# EasyEDA Pro project 800480_4.3LCD.eprj

# Schematic Schematic1
Board Name: Board1; Create Date: 2024-09-07
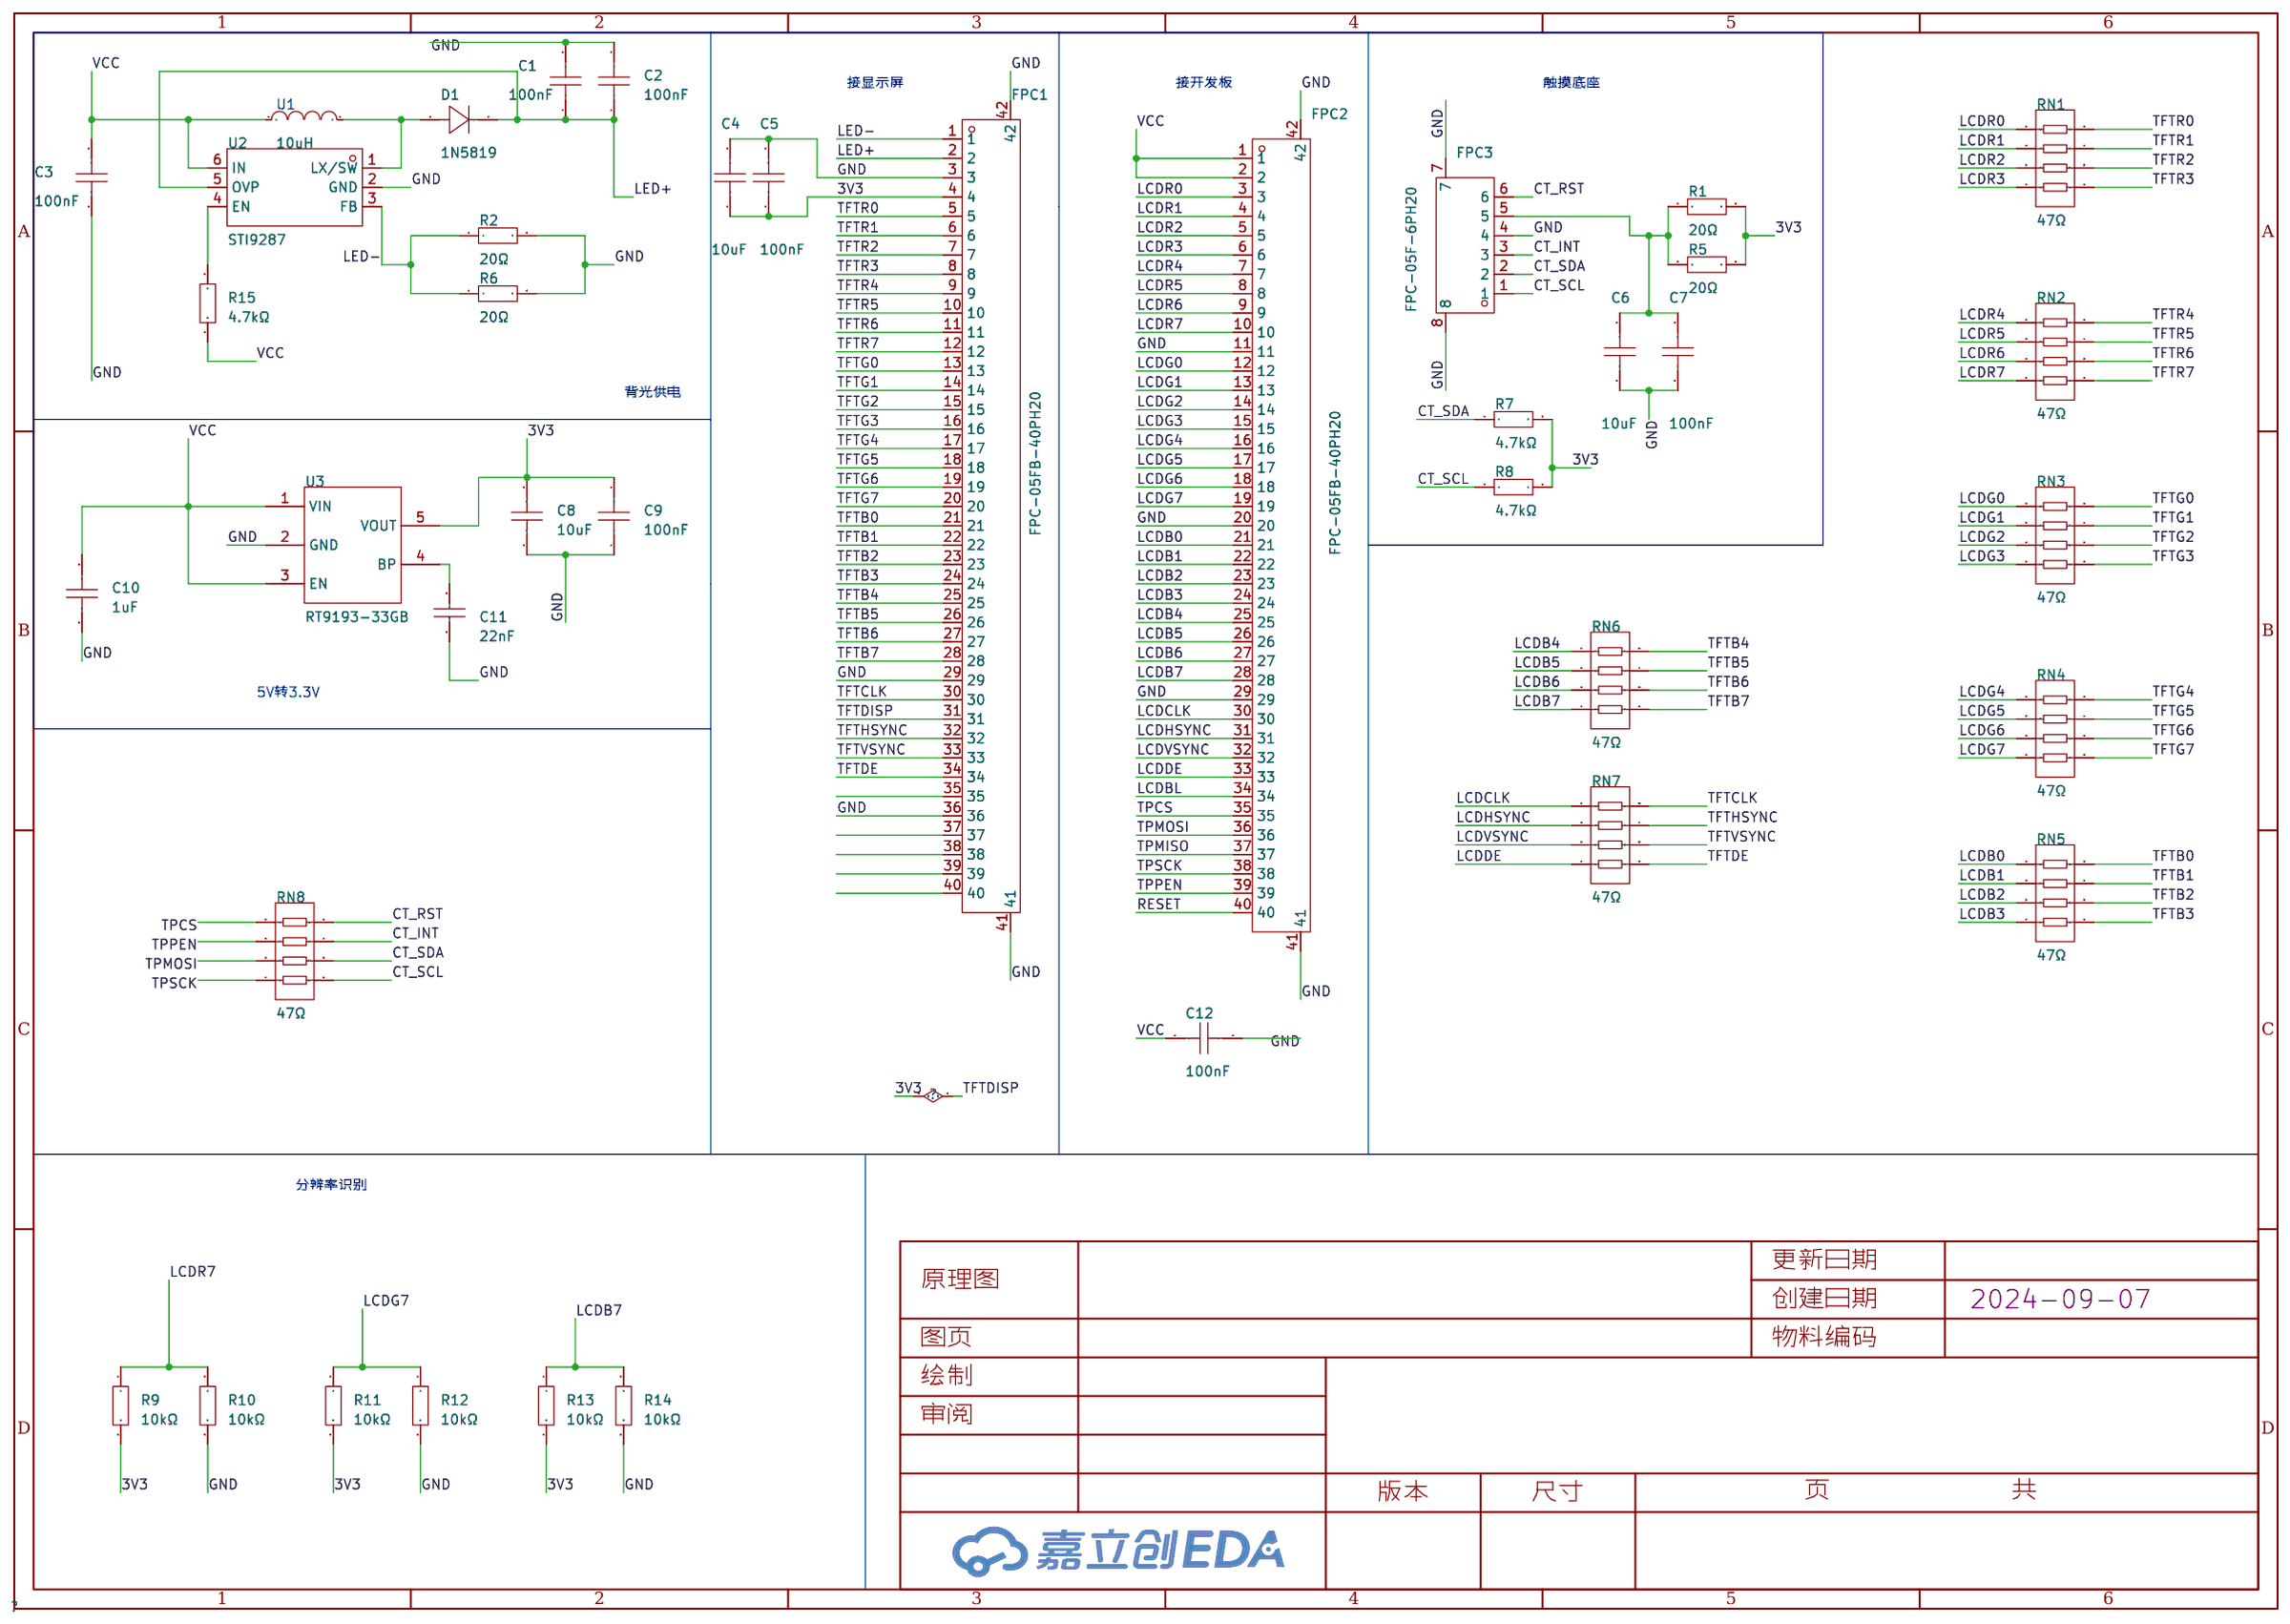
[diagram p0: schematic sheet]

## Parts
C1  100nF  [C0603]
C2  100nF  [C0603]
C3  100nF  [C0603]
C4  10uF  [C0603]
C5  100nF  [C0603]
C6  10uF  [C0603]
C7  100nF  [C0603]
C8  10uF  [C0603]
C9  100nF  [C0603]
C10  1uF  [C0603]
C11  22nF  [C0603]
C12  100nF  [C0603]
D1  1N5819  [SMA_L4.3-W2.6-LS5.1-RD]
FPC1  FPC-05FB-40PH20  [FPC-SMD_40P-P0.50_XUNPU_FPC-05FB-40PH20]
FPC2  FPC-05FB-40PH20  [FPC-SMD_40P-P0.50_XUNPU_FPC-05FB-40PH20]
FPC3  FPC-05F-6PH20  [FPC-SMD_6P-P0.50_XUNPU_FPC-05F-6PH20]
R1  20Ω  [R0603]
R2  20Ω  [R0603]
R5  20Ω  [R0603]
R6  20Ω  [R0603]
R7  4.7kΩ  [R0603]
R8  4.7kΩ  [R0603]
R9  10kΩ  [R0603]
R10  10kΩ  [R0603]
R11  10kΩ  [R0603]
R12  10kΩ  [R0603]
R13  10kΩ  [R0603]
R14  10kΩ  [R0603]
R15  4.7kΩ  [R0603]
RN1  47Ω  [RES-ARRAY-SMD_0603-8P-L3.2-W1.6-BL]
RN2  47Ω  [RES-ARRAY-SMD_0603-8P-L3.2-W1.6-BL]
RN3  47Ω  [RES-ARRAY-SMD_0603-8P-L3.2-W1.6-BL]
RN4  47Ω  [RES-ARRAY-SMD_0603-8P-L3.2-W1.6-BL]
RN5  47Ω  [RES-ARRAY-SMD_0603-8P-L3.2-W1.6-BL]
RN6  47Ω  [RES-ARRAY-SMD_0603-8P-L3.2-W1.6-BL]
RN7  47Ω  [RES-ARRAY-SMD_0603-8P-L3.2-W1.6-BL]
RN8  47Ω  [RES-ARRAY-SMD_0603-8P-L3.2-W1.6-BL]
U1  10uH  [IND-SMD_L4.0-W4.0_LVF404015]
U2  STI9287  [SOT-23-6_L2.9-W1.6-P0.95-LS2.8-BL]
U3  RT9193-33GB  [SOT-23-5_L3.0-W1.7-P0.95-LS2.8-BL]

## Library data of the parts
C1-C3 C5 C7 C9 C12 = CC0603KRX7R9BB104: LCSC Part Name: 100nF ±10% 50V; Supplier Part: C14663; Manufacturer: YAGEO(国巨); Supplier Footprint: 0603; JLCPCB Part Class: Basic Part; Datasheet: https://atta.szlcsc.com/upload/public/pdf/source/20180910/C282072_33301C7F631E79921B82A8DAC6BCC5B3.pdf; Supplier: LCSC; Tolerance: ±10%; Voltage Rated: 50V; Temperature Coefficient: X7R
C4 C6 C8 = CL10A106KP8NNNC: LCSC Part Name: 10uF ±10% 10V; Supplier Part: C19702; Manufacturer: SAMSUNG(三星); Supplier Footprint: 0603; JLCPCB Part Class: 基础库; Datasheet: https://atta.szlcsc.com/upload/public/pdf/source/20160218/1457707763339.pdf; Supplier: LCSC; Tolerance: ±10%; Voltage Rated: 10V; Temperature Coefficient: X5R
C10 = CL10A105KB8NNNC: LCSC Part Name: 1uF ±10% 50V; Supplier Part: C15849; Manufacturer: SAMSUNG(三星); Supplier Footprint: 0603; JLCPCB Part Class: 基础库; Datasheet: https://atta.szlcsc.com/upload/public/pdf/source/20160218/1457707763339.pdf; Supplier: LCSC; Tolerance: ±10%; Voltage Rated: 50V; Temperature Coefficient: X5R
C11 = CL10B223KB8NNNC: LCSC Part Name: 22nF ±10% 50V; Supplier Part: C21122; Manufacturer: SAMSUNG(三星); Supplier Footprint: 0603; JLCPCB Part Class: 基础库; Datasheet: https://atta.szlcsc.com/upload/public/pdf/source/20160218/1457707763339.pdf; Supplier: LCSC; Tolerance: ±10%; Voltage Rated: 50V; Temperature Coefficient: X7R
D1 = 1N5819: Supplier Part: C9900008009; JLCPCB Part Class: 扩展库; Supplier: LCSC
FPC1 FPC2 = FPC-05FB-40PH20: LCSC Part Name: 间距:0.5mm P数:40P 翻盖式 双侧触点/上下接; Supplier Part: C2856837; Manufacturer: XUNPU(讯普); Supplier Footprint: SMD,P=0.5mm,卧贴; JLCPCB Part Class: 扩展库; Datasheet: https://atta.szlcsc.com/upload/public/pdf/source/20210922/C2856837_A0FF02895414764A7F2E525E58748FC4.pdf; Supplier: LCSC; Locking Feature: 翻盖式; Contact Type: 双侧触点/上下接; Number of Contacts: 40P; Pitch: 0.5mm; Mounting Type: 卧贴; FFC, FCB Thickness: 0.3mm; Height Above Board: 2mm; Operating Temperature Range: -25℃~+85℃
FPC3 = FPC-05F-6PH20: LCSC Part Name: 间距:0.5mm P数:6P 翻盖式 下接; Supplier Part: C2856796; Manufacturer: XUNPU(讯普); Supplier Footprint: SMD,P=0.5mm,卧贴; JLCPCB Part Class: 扩展库; Datasheet: https://atta.szlcsc.com/upload/public/pdf/source/20210922/16B003FB53336DDF6538142CC465AC4D.pdf; Supplier: LCSC; Locking Feature: 翻盖式; Contact Type: 下接; Number of Contacts: 6P; Pitch: 0.5mm; Mounting Type: 卧贴; FFC, FCB Thickness: 0.3mm; Height Above Board: 2mm; Operating Temperature Range: -25℃~+85℃
R1 R2 R5 R6 = 0603WAF200JT5E: LCSC Part Name: 20Ω ±1% 100mW 厚膜电阻; Supplier Part: C22950; Manufacturer: UNI-ROYAL(厚声); Supplier Footprint: 0603; JLCPCB Part Class: 基础库; Datasheet: https://atta.szlcsc.com/upload/public/pdf/source/20200306/C422600_1E6D84923E4A46A82E41ADD87F860B5C.pdf; Supplier: LCSC; Type: 厚膜电阻; Tolerance: ±1%; Power(Watts): 100mW; Overload Voltage (Max): 75V; Temperature Coefficient: ±100ppm/℃; Operating Temperature Range: -55℃~+155℃
R7 R8 R15 = RC0603FR-074K7L: LCSC Part Name: 厚膜电阻 4.7kΩ ±1% 100mW; Supplier Part: C99782; Manufacturer: YAGEO(国巨); Supplier Footprint: 0603; JLCPCB Part Class: 扩展库; Datasheet: https://atta.szlcsc.com/upload/public/pdf/source/20180224/C181757_15194369480721363983.pdf; Supplier: LCSC; Type: 厚膜电阻; Tolerance: ±1%; Power(Watts): 100mW; Overload Voltage (Max): 75V; Temperature Coefficient: ±100ppm/℃; Operating Temperature Range: -55℃~+155℃
R9-R14 = RC0603FR-0710KL: LCSC Part Name: 厚膜电阻 10kΩ ±1% 100mW; Supplier Part: C98220; Manufacturer: YAGEO(国巨); Supplier Footprint: 0603; JLCPCB Part Class: Extended Part; Datasheet: https://atta.szlcsc.com/upload/public/pdf/source/20180927/C295883_E8D83085EA81BD7DE0B2B681138C15EE.pdf; Supplier: LCSC; Type: 厚膜电阻; Tolerance: ±1%; Power(Watts): 100mW; Overload Voltage (Max): 75V; Temperature Coefficient: ±100ppm/℃; Operating Temperature Range: -55℃~+155℃
RN1-RN8 = 4D03WGF470JT5E: LCSC Part Name: 47Ω ±1%; Supplier Part: C425204; Manufacturer: UNI-ROYAL(厚声); Supplier Footprint: 0603x4; JLCPCB Part Class: 扩展库; Datasheet: https://atta.szlcsc.com/upload/public/pdf/source/20191224/C474318_2527498AE30E813171187CCD28401A71.pdf; Supplier: LCSC; Number of Resistors: 4; Tolerance: ±1%; Power(Watts): 62.5mW; Temperature Coefficient: ±200ppm/℃; Number of Pins: 8
U1 = 10uH: Supplier Part: C9900025245; Supplier Footprint: IND-SMD; JLCPCB Part Class: 扩展库; Supplier: LCSC
U2 = STI9287: Supplier Part: C842664; Manufacturer: TMI(拓尔微); Supplier Footprint: SOT-23-6; JLCPCB Part Class: Extended Part; Datasheet: https://atta.szlcsc.com/upload/public/pdf/source/20240703/B128564ECC0624FCB41061FE80512E84.pdf; Supplier: LCSC
U3 = RT9193-33GB: LCSC Part Name: 输入5.5V 输出3.3V 300mA; Supplier Part: C15651; Manufacturer: RICHTEK(立锜); Supplier Footprint: SOT-23-5; JLCPCB Part Class: 扩展库; Datasheet: https://atta.szlcsc.com/upload/public/pdf/source/20130730/1457706628575.pdf; Supplier: LCSC; Output Type: 固定; Maximum Input Voltage: 5.5V; Output Voltage: 3.3V; MAX Output Current: 300mA; Power Supply Rejection Ratio (PSRR): 70dB; Dropout Voltage: 300mV@(300mA); standby current: 130uA; Operating Temperature: -40℃~+125℃; Output Polarity: 正极; Number of Outputs: 1

## Nets
3V3: C4.1 C5.1 C8.2 C9.2 FPC1.4 FPC1.31 R1.2 R5.2 R7.2 R8.2 R9.2 R11.2 R13.2 U3.5(VOUT)
GND: C1.2 C2.2 C3.1 C4.2 C5.2 C6.1 C7.1 C8.1 C9.1 C10.1 C11.1 C12.1 FPC1.3 FPC1.29 FPC1.36 FPC1.41 FPC1.42 FPC2.11 FPC2.20 FPC2.29 FPC2.41 FPC2.42 FPC3.4 FPC3.7 FPC3.8 R2.2 R6.2 R10.2 R12.2 R14.2 U2.2(GND) U3.2(GND)
VCC: C3.2 C10.2 C12.2 FPC2.1 FPC2.2 R15.1 U1.1 U2.6(IN) U3.1(VIN) U3.3(EN)
CT_INT: FPC3.3 RN8.7
CT_RST: FPC3.6 RN8.8
CT_SCL: FPC3.1 R8.1 RN8.5
CT_SDA: FPC3.2 R7.1 RN8.6
LCDB0: FPC2.21 RN5.1
LCDB1: FPC2.22 RN5.2
LCDB2: FPC2.23 RN5.3
LCDB3: FPC2.24 RN5.4
LCDB4: FPC2.25 RN6.1
LCDB5: FPC2.26 RN6.2
LCDB6: FPC2.27 RN6.3
LCDB7: FPC2.28 R13.1 R14.1 RN6.4
LCDBL: FPC2.34
LCDCLK: FPC2.30 RN7.1
LCDDE: FPC2.33 RN7.4
LCDG0: FPC2.12 RN3.1
LCDG1: FPC2.13 RN3.2
LCDG2: FPC2.14 RN3.3
LCDG3: FPC2.15 RN3.4
LCDG4: FPC2.16 RN4.1
LCDG5: FPC2.17 RN4.2
LCDG6: FPC2.18 RN4.3
LCDG7: FPC2.19 R11.1 R12.1 RN4.4
LCDHSYNC: FPC2.31 RN7.2
LCDR0: FPC2.3 RN1.1
LCDR1: FPC2.4 RN1.2
LCDR2: FPC2.5 RN1.3
LCDR3: FPC2.6 RN1.4
LCDR4: FPC2.7 RN2.1
LCDR5: FPC2.8 RN2.2
LCDR6: FPC2.9 RN2.3
LCDR7: FPC2.10 R9.1 R10.1 RN2.4
LCDVSYNC: FPC2.32 RN7.3
LED+: C1.1 C2.1 D1.1(K) FPC1.2 U2.5(OVP)
LED-: FPC1.1 R2.1 R6.1 U2.3(FB)
RESET: FPC2.40
TFTB0: FPC1.21 RN5.8
TFTB1: FPC1.22 RN5.7
TFTB2: FPC1.23 RN5.6
TFTB3: FPC1.24 RN5.5
TFTB4: FPC1.25 RN6.8
TFTB5: FPC1.26 RN6.7
TFTB6: FPC1.27 RN6.6
TFTB7: FPC1.28 RN6.5
TFTCLK: FPC1.30 RN7.8
TFTDE: FPC1.34 RN7.5
TFTG0: FPC1.13 RN3.8
TFTG1: FPC1.14 RN3.7
TFTG2: FPC1.15 RN3.6
TFTG3: FPC1.16 RN3.5
TFTG4: FPC1.17 RN4.8
TFTG5: FPC1.18 RN4.7
TFTG6: FPC1.19 RN4.6
TFTG7: FPC1.20 RN4.5
TFTHSYNC: FPC1.32 RN7.7
TFTR0: FPC1.5 RN1.8
TFTR1: FPC1.6 RN1.7
TFTR2: FPC1.7 RN1.6
TFTR3: FPC1.8 RN1.5
TFTR4: FPC1.9 RN2.8
TFTR5: FPC1.10 RN2.7
TFTR6: FPC1.11 RN2.6
TFTR7: FPC1.12 RN2.5
TFTVSYNC: FPC1.33 RN7.6
TPCS: FPC2.35 RN8.1
TPMISO: FPC2.37
TPMOSI: FPC2.36 RN8.3
TPPEN: FPC2.39 RN8.2
TPSCK: FPC2.38 RN8.4
$1N628: D1.2(A) U1.2 U2.1(LX/SW)
$1N696: R15.2 U2.4(EN)
$1N3439: C11.2 U3.4(BP)
$1N4082: C6.2 C7.2 FPC3.5 R1.1 R5.1

Not connected (* = marked no-connect by the designer): FPC1 35 37 38 39 40

## Notes on the sheet
- 接显示屏
- 接开发板
- 触摸底座
- 背光供电
- 5V转3.3V
- 分辨率识别

# Board PCB1
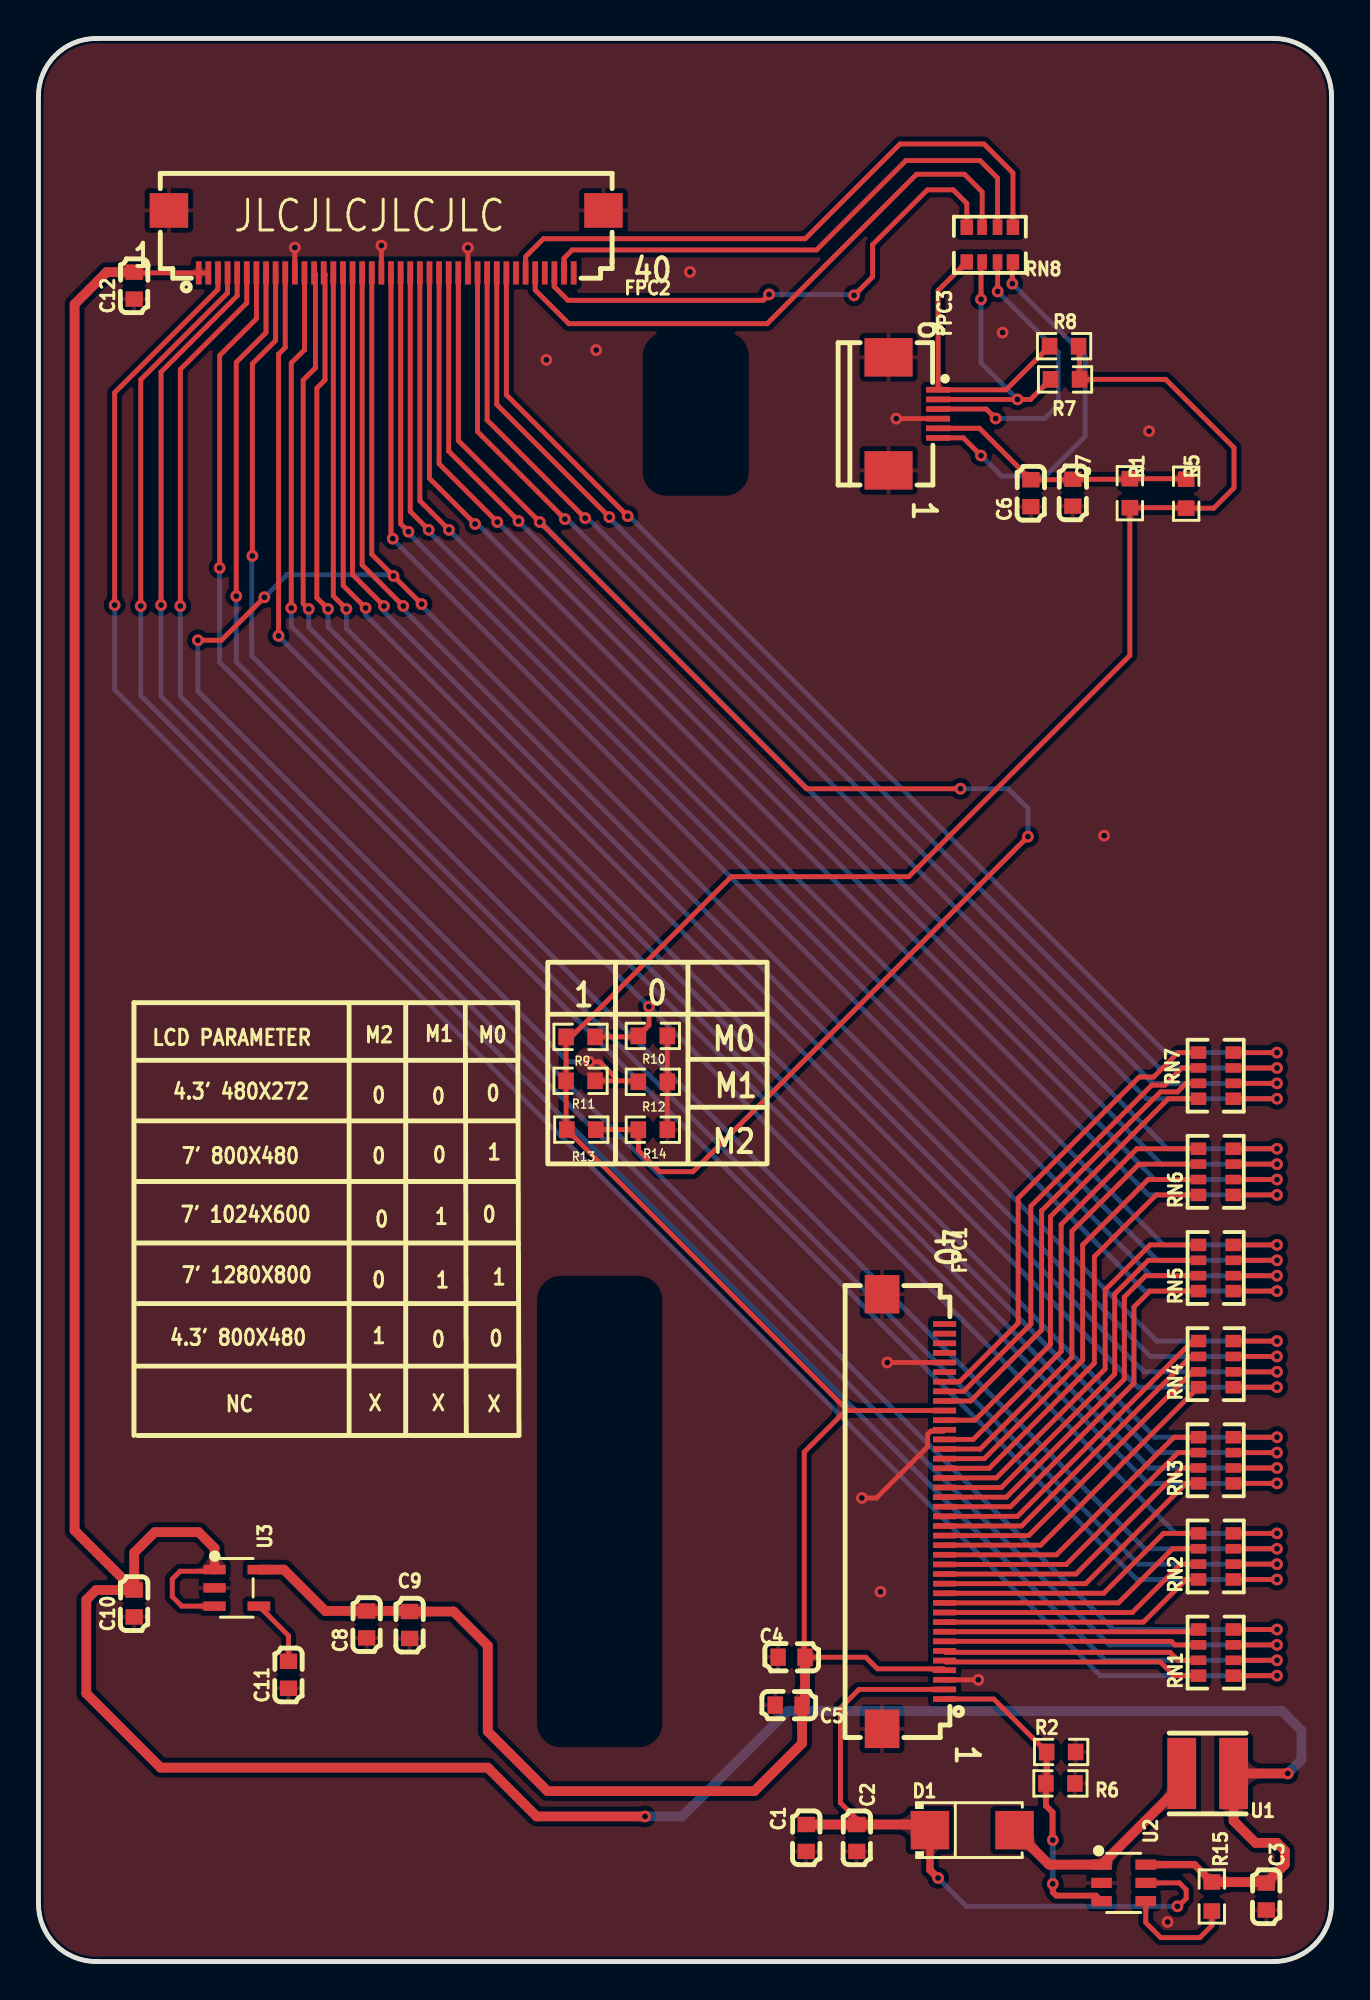
[diagram p1: board, top side]
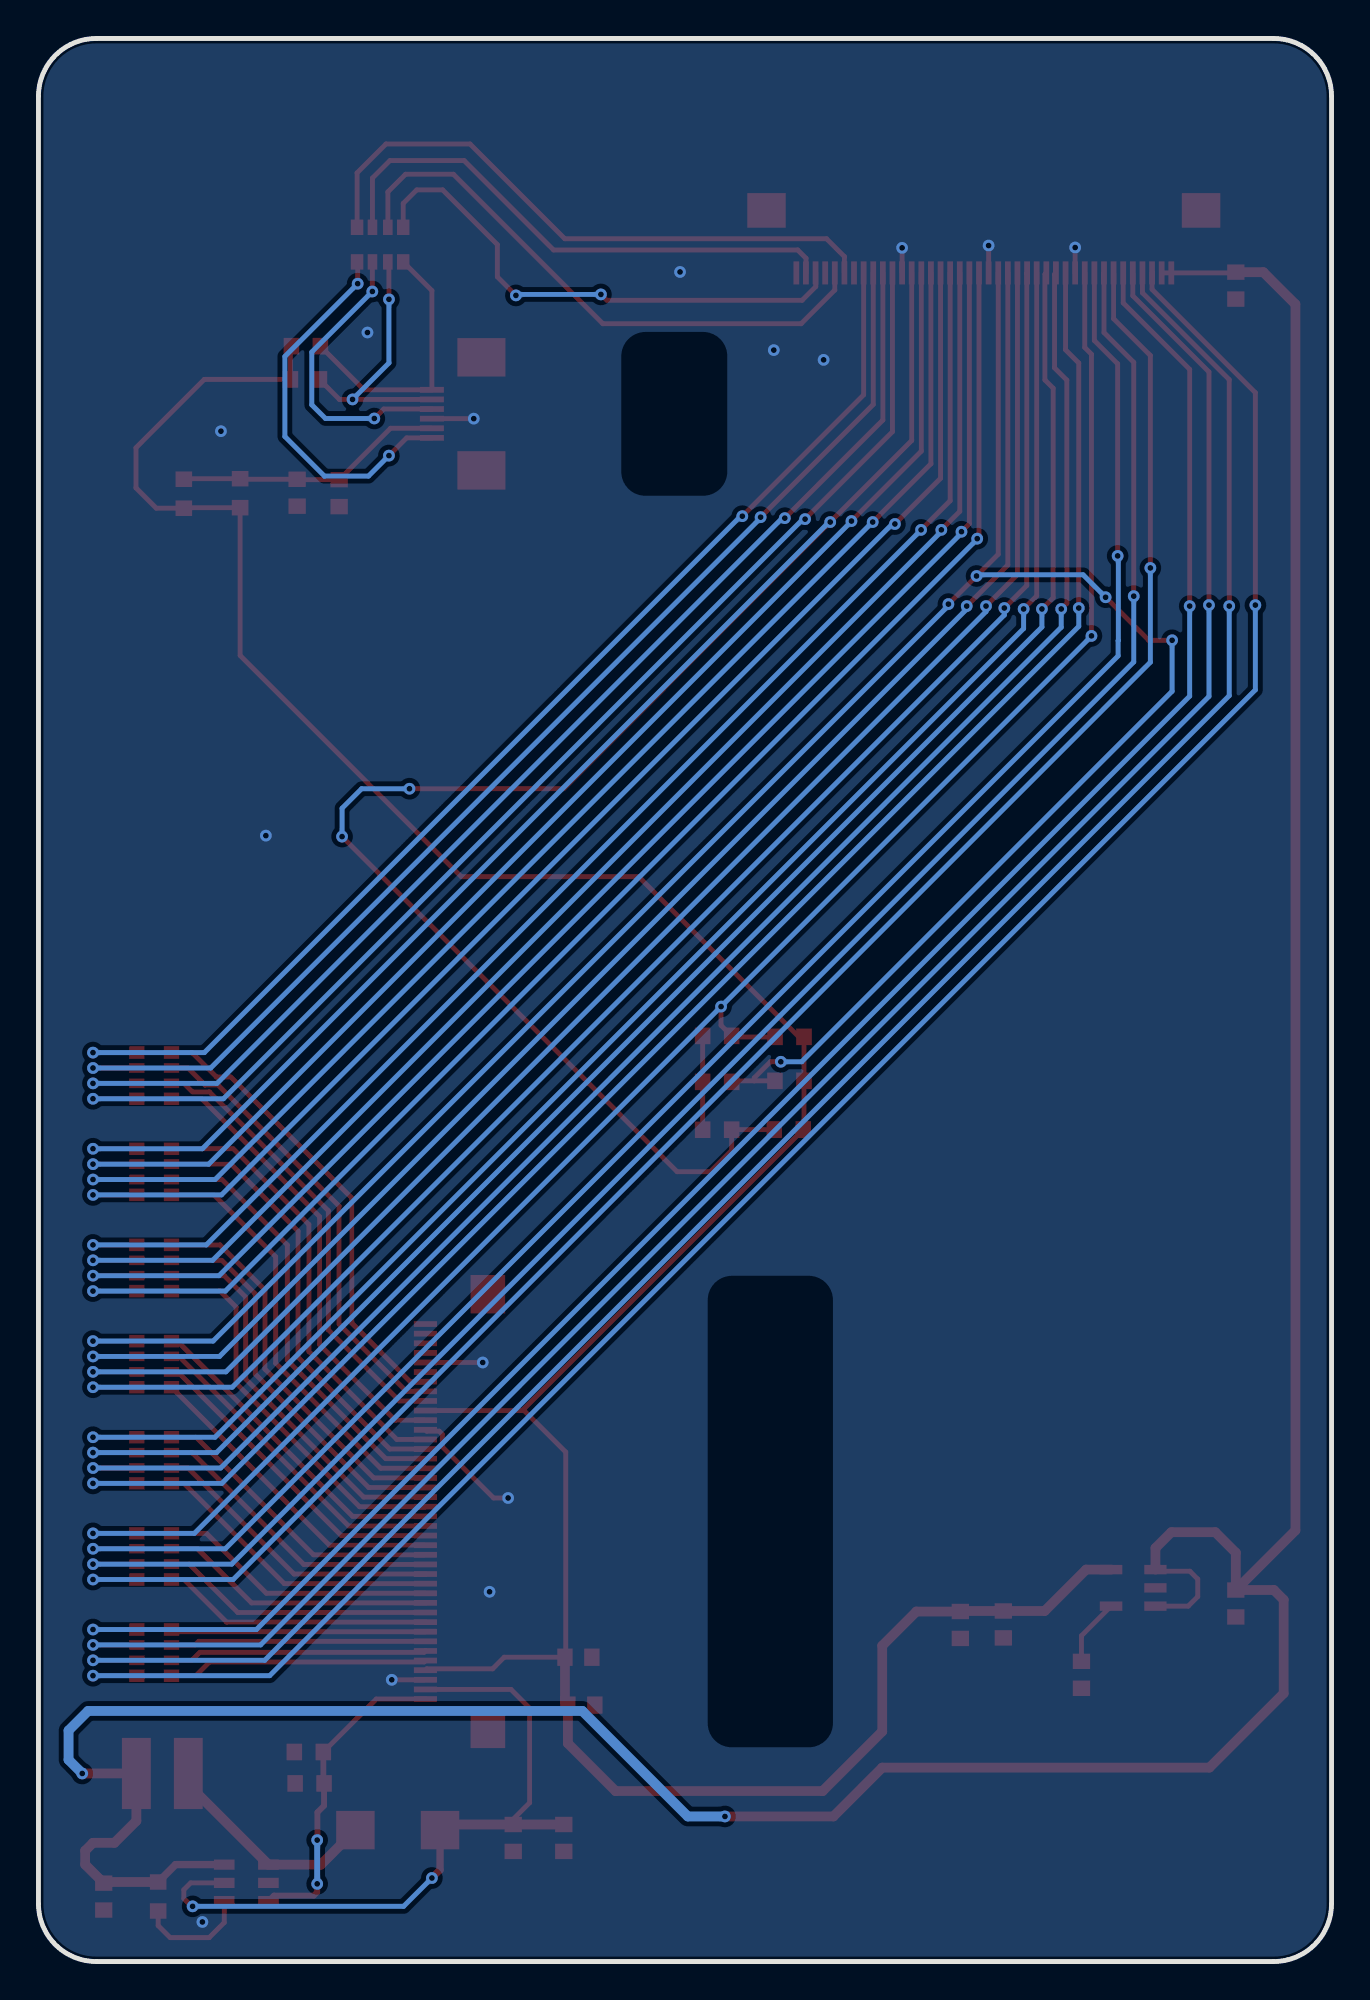
[diagram p2: board, bottom side, seen from below]

Outline 67.25 x 100 mm; copper layers: Top Layer, Bottom Layer. Coordinates in mm from the lower left corner of the outline.
Outline path: 0,97 0,3 arc(0.88,0.88) 3,0 64.25,0 arc(66.37,0.88) 67.25,3 67.25,97 arc(66.37,99.12) 64.25,100 3,100 arc(0.88,99.12) 0,97
Stack: Top Layer 0.035mm / Dielectric1 1.51mm FR4 er 4.5 / Bottom Layer 0.035mm

## Design rules (mm)
template: JLCPCB Capability(Two Layers Board)
spacing copperThickness1oz (default): track to track 0.102, other pairs 0.152 to 0.3
spacing copperThickness2oz: track to track 0.203, other pairs 0.152 to 0.3
track width copperThickness1oz (default): min 0.127, default 0.254, max 2.54
track width copperThickness2oz: min 0.203, default 0.254, max 2.54
differential pair differentialPair (default): width min 0.127, default 0.254, max 2.54; gap min 0.152, default 0.152
via viaSize (default): diameter min 0.5, default 0.61, max 10; hole min 0.3, default 0.305, max 6.3

## Placement (name value [footprint] x y rotation side)
C1  100nF  [C0603]  39.93 6.43 270 top
C2  100nF  [C0603]  42.56 6.43 270 top
C3  100nF  [C0603]  63.86 3.38 90 top
C4  10uF  [C0603]  39.17 15.82 180 top
C5  100nF  [C0603]  39.01 13.34 180 top
C6  10uF  [C0603]  51.61 76.36 90 top
C7  100nF  [C0603]  53.8 76.38 90 top
C8  10uF  [C0603]  17.07 17.53 90 top
C9  100nF  [C0603]  19.3 17.5 90 top
C10  1uF  [C0603]  4.98 18.62 90 top
C11  22nF  [C0603]  13 14.91 90 top
C12  100nF  [C0603]  4.98 87.15 90 top
D1  1N5819  [SMA_L4.3-W2.6-LS5.1-RD]  48.56 6.83 0 top
FPC1  FPC-05FB-40PH20  [FPC-SMD_40P-P0.50_XUNPU_FPC-05FB-40PH20]  45.5 23.4 270 top
FPC2  FPC-05FB-40PH20  [FPC-SMD_40P-P0.50_XUNPU_FPC-05FB-40PH20]  18.09 89.43 180 top
FPC3  FPC-05F-6PH20  [FPC-SMD_6P-P0.50_XUNPU_FPC-05F-6PH20]  45.5 80.48 270 top
R1  20Ω  [R0603]  56.76 76.35 270 top
R2  20Ω  [R0603]  53.19 10.9 0 top
R5  20Ω  [R0603]  59.69 76.33 270 top
R6  20Ω  [R0603]  53.15 9.26 0 top
R7  4.7kΩ  [R0603]  53.39 82.27 0 top
R8  4.7kΩ  [R0603]  53.34 84 0 top
R9  10kΩ  [R0603]  28.19 48.08 180 top
R10  10kΩ  [R0603]  31.95 48.13 0 top
R11  10kΩ  [R0603]  28.19 45.8 180 top
R12  10kΩ  [R0603]  31.95 45.75 0 top
R13  10kΩ  [R0603]  28.23 43.26 180 top
R14  10kΩ  [R0603]  31.95 43.26 0 top
R15  4.7kΩ  [R0603]  61.02 3.38 270 top
RN1  47Ω  [RES-ARRAY-SMD_0603-8P-L3.2-W1.6-BL]  61.23 16.06 90 top
RN2  47Ω  [RES-ARRAY-SMD_0603-8P-L3.2-W1.6-BL]  61.23 21.06 90 top
RN3  47Ω  [RES-ARRAY-SMD_0603-8P-L3.2-W1.6-BL]  61.23 26.06 90 top
RN4  47Ω  [RES-ARRAY-SMD_0603-8P-L3.2-W1.6-BL]  61.23 31.06 90 top
RN5  47Ω  [RES-ARRAY-SMD_0603-8P-L3.2-W1.6-BL]  61.23 36.06 90 top
RN6  47Ω  [RES-ARRAY-SMD_0603-8P-L3.2-W1.6-BL]  61.23 41.06 90 top
RN7  47Ω  [RES-ARRAY-SMD_0603-8P-L3.2-W1.6-BL]  61.23 46.06 90 top
RN8  47Ω  [RES-ARRAY-SMD_0603-8P-L3.2-W1.6-BL]  49.48 89.28 180 top
U1  10uH  [IND-SMD_L4.0-W4.0_LVF404015]  60.81 9.78 180 top
U2  STI9287  [SOT-23-6_L2.9-W1.6-P0.95-LS2.8-BL]  56.44 4.09 270 top
U3  RT9193-33GB  [SOT-23-5_L3.0-W1.7-P0.95-LS2.8-BL]  10.31 19.43 270 top

## Footprints (pads in the part's own frame, mm; a bottom-side part is the same pattern mirrored in y, then rotated)
C0603
  rect 0.8x0.9 smd: 1(-0.7,0) 2(0.7,0)
FPC-SMD_6P-P0.50_XUNPU_FPC-05F-6PH20
  rect 0.3x1.25 smd: 1(-1.25,1.288) 2(-0.75,1.288) 3(-0.25,1.288) 4(0.25,1.288) 5(0.75,1.288) 6(1.25,1.288)
  rect 2x2.5 smd: 7(2.94,-1.288) 8(-2.94,-1.288)
FPC-SMD_40P-P0.50_XUNPU_FPC-05FB-40PH20
  rect 0.3x1.2 smd: 1(9.75,1.625) 2(9.25,1.625) 3(8.75,1.625) 4(8.25,1.625) 5(7.75,1.625) 6(7.25,1.625) 7(6.75,1.625) 8(6.25,1.625) 9(5.75,1.625) 10(5.25,1.625) 11(4.75,1.625) 12(4.25,1.625) 13(3.75,1.625) 14(3.25,1.625) 15(2.75,1.625) 16(2.25,1.625) 17(1.75,1.625) 18(1.25,1.625) 19(0.75,1.625) 20(0.25,1.625) 21(-0.25,1.625) 22(-0.75,1.625) 23(-1.25,1.625) 24(-1.75,1.625) 25(-2.25,1.625) 26(-2.75,1.625) 27(-3.25,1.625) 28(-3.75,1.625) 29(-4.25,1.625) 30(-4.75,1.625) 31(-5.25,1.625) 32(-5.75,1.625) 33(-6.25,1.625) 34(-6.75,1.625) 35(-7.25,1.625) 36(-7.75,1.625) 37(-8.25,1.625) 38(-8.75,1.625) 39(-9.25,1.625) 40(-9.75,1.625)
  rect 2x1.8 smd: 41(-11.3,-1.625) 42(11.3,-1.625)
IND-SMD_L4.0-W4.0_LVF404015
  rect 1.5x3.7 smd: 1(-1.35,0) 2(1.35,0)
R0603
  rect 0.806x0.864 smd: 1(-0.753,0) 2(0.753,0)
RES-ARRAY-SMD_0603-8P-L3.2-W1.6-BL
  rect 0.65x0.8 smd: 1(-1.2,-0.9) 4(1.2,-0.9) 5(1.2,0.9) 8(-1.2,0.9)
  rect 0.5x0.8 smd: 2(-0.4,-0.9) 3(0.4,-0.9) 6(0.4,0.9) 7(-0.4,0.9)
SMA_L4.3-W2.6-LS5.1-RD
  rect 2x2 smd: 1(-2.2,0) 2(2.2,0)
SOT-23-5_L3.0-W1.7-P0.95-LS2.8-BL
  rect 0.49x1.157 smd: 1(-0.95,-1.153) 2(0,-1.153) 3(0.95,-1.153)
  rect 0.49x1.175 smd: 4(0.95,1.153) 5(-0.95,1.153)
SOT-23-6_L2.9-W1.6-P0.95-LS2.8-BL
  rect 0.532x1.072 smd: 1(-0.95,-1.149) 2(0,-1.149) 3(0.95,-1.149) 4(0.95,1.149) 5(0,1.149) 6(-0.95,1.149)

## Nets
As in the schematic.

## Via types
v1: diameter 0.61, hole 0.305, Top Layer to Bottom Layer, 92 vias

## Routing (per net, layer and track width the routed paths; a pad name or vN(x,y) marks a point on that pad's centre or on a via; arc(x,y) is an arc through that point)
3V3: length 157.5
  Top Layer w0.254: FPC1.4 47.05,15.22 43.63,15.22 43.03,15.82 C4.1 39.83,15.86 39.83,26.49 41.98,28.65 42.09,28.65 ; 42.09,28.65 27.44,43.3 R11.2 R9.2 27.71,48.08 36.04,56.41 45.26,56.41 56.76,67.92 R1.2 59.66,75.6 R5.2 61.12,75.57 62.18,76.63 62.18,78.72 58.62,82.27 R7.2 54.14,83.95 R8.2 ; 42.09,28.65 FPC1.31
  Top Layer w0.508: C4.1 39.87,13.49 C5.1 39.71,11.34 37.24,8.87 26.47,8.87 23.37,11.96 23.37,16.42 21.59,18.2 C9.2 19.28,18.23 C8.2 14.92,18.23 12.77,20.38 U3.5
GND: length 22
  Top Layer w0.254: FPC3.4 v1(44.61,80.23) ; 13.33,87.81 v1(13.33,89.13) ; FPC2.20 v1(17.83,89.23) ; FPC1.3 v1(48.88,14.65) ; v1(44.15,31.15) FPC1.36 ; 22.33,87.81 v1(22.33,89.11) ; R10.2 R12.2 R14.2 ; v1(42.82,24.1) 43.58,24.1 46.25,26.77 46.25,27.42 46.41,27.58 47.05,27.58 FPC1.29
  vias: v1(26.42,83.29) v1(29.01,83.8) v1(33.88,87.86) v1(43.79,19.23) v1(50.14,84.71) v1(55.42,58.55) v1(57.76,79.58) v1(58.72,2.06)
VCC: length 185.6
  Top Layer w0.254: 9.16,20.38 9.07,20.29 7.37,20.29 6.96,19.89 6.96,18.97 7.45,18.48 9.16,18.48 ; 8.83,87.81 FPC2.1 4.98,87.81 4.98,87.75
  Top Layer w0.381: R15.1 60.12,5.04 U2.6
  Top Layer w0.508: v1(31.55,7.54) 25.91,7.54 23.37,10.08 6.35,10.08 2.49,13.94 2.49,18.81 3,19.32 C10.2 ; 9.16,20.38 9.16,21.5 8.33,22.33 6.05,22.33 4.98,21.26 C10.2 ; R15.1 63.8,4.13 C3.2 64.82,5.04 64.82,5.77 64.41,6.17 63.3,6.17 62.16,7.31 U1.1 v1(64.97,9.78) ; C10.2 1.88,22.42 1.88,86.18 3.55,87.85 C12.2
  Bottom Layer w0.508: v1(31.55,7.54) 33.48,7.54 38.96,13.03 64.67,13.03 65.68,12.01 65.68,10.49 v1(64.97,9.78)
CT_INT: length 15.5
  Top Layer w0.254: v1(49.78,80.24) 49.29,80.73 FPC3.3 ; RN8.7 49.89,88.38 v1(49.89,86.84)
  Bottom Layer w0.254: v1(49.78,80.24) 52.32,80.24 53.03,80.95 53.03,83.69 v1(49.89,86.84)
CT_RST: length 20
  Top Layer w0.254: RN8.8 50.65,88.35 v1(50.65,87.25) ; v1(49.02,78.31) 48.1,79.23 FPC3.6
  Bottom Layer w0.254: v1(49.02,78.31) 50.09,77.24 52.38,77.24 54.43,79.3 54.43,83.46 v1(50.65,87.25)
CT_SCL: length 14
  Top Layer w0.254: RN8.5 46.79,86.89 FPC3.1 50.32,81.73 R8.1
CT_SDA: length 14.2
  Top Layer w0.254: RN8.6 49.02,88.32 v1(49.02,86.44) ; FPC3.2 v1(50.92,81.23) 51.6,81.23 R7.1
  Bottom Layer w0.254: v1(50.92,81.23) 49.02,83.12 v1(49.02,86.44)
LCDB0: length 78.3
  Top Layer w0.254: RN5.1 v1(64.41,34.86) ; 18.33,87.81 18.33,74.08 v1(18.43,73.99)
  Bottom Layer w0.254: v1(64.41,34.86) 57.53,34.86 18.43,73.96 v1(18.43,73.99)
LCDB1: length 77.1
  Top Layer w0.254: FPC2.22 18.84,74.76 v1(19.25,74.35) ; RN5.2 v1(64.41,35.66)
  Bottom Layer w0.254: v1(19.25,74.35) 19.25,74.28 57.86,35.66 v1(64.41,35.66)
LCDB2: length 75.9
  Top Layer w0.254: v1(20.29,74.45) 19.33,75.41 19.33,87.81 ; RN5.3 v1(64.41,36.46)
  Bottom Layer w0.254: v1(64.41,36.46) 58.19,36.46 20.29,74.36 v1(20.29,74.45)
LCDB3: length 74.7
  Top Layer w0.254: RN5.4 v1(64.41,37.26) ; FPC2.24 19.84,75.96 v1(21.35,74.45)
  Bottom Layer w0.254: v1(64.41,37.26) 58.52,37.26 21.35,74.44 v1(21.35,74.45)
LCDB4: length 72.5
  Top Layer w0.254: v1(22.71,74.75) 20.33,77.13 20.33,87.81 ; RN6.1 v1(64.41,39.86)
  Bottom Layer w0.254: v1(64.41,39.86) 57.73,39.86 22.84,74.75 v1(22.71,74.75)
LCDB5: length 71.2
  Top Layer w0.254: RN6.2 v1(64.41,40.66) ; v1(23.86,74.85) 20.84,77.88 FPC2.26
  Bottom Layer w0.254: v1(23.86,74.85) 23.87,74.85 58.06,40.66 v1(64.41,40.66)
LCDB6: length 70
  Top Layer w0.254: RN6.3 v1(64.41,41.46) ; v1(24.97,74.91) 21.33,78.54 21.33,87.81
  Bottom Layer w0.254: v1(24.97,74.91) 24.97,74.89 58.39,41.46 v1(64.41,41.46)
LCDB7: length 133.1
  Top Layer w0.254: v1(51.46,58.5) 34.04,41.07 32.31,41.07 31.2,42.18 R14.1 31.2,43.26 R13.1 ; v1(47.96,60.99) 39.94,60.99 v1(26.07,74.85) 21.84,79.09 FPC2.28 ; RN6.4 v1(64.41,42.26)
  Bottom Layer w0.254: v1(47.96,60.99) 50.44,60.99 51.46,59.97 v1(51.46,58.5) ; v1(26.07,74.85) 26.13,74.85 58.72,42.26 v1(64.41,42.26)
LCDCLK: length 66.5
  Top Layer w0.254: v1(27.38,75.01) 22.84,79.55 FPC2.30 ; RN7.1 v1(64.41,44.86)
  Bottom Layer w0.254: v1(27.38,75.01) 27.49,75.01 57.63,44.86 v1(64.41,44.86)
LCDDE: length 62.9
  Top Layer w0.254: v1(30.64,75.16) 24.33,81.47 24.33,87.81 ; RN7.4 v1(64.41,47.26)
  Bottom Layer w0.254: v1(64.41,47.26) 58.62,47.26 30.73,75.16 v1(30.64,75.16)
LCDG0: length 90.7
  Top Layer w0.254: v1(13.15,70.38) 13.15,83.12 13.83,83.81 13.83,87.81 ; RN3.1 v1(64.41,24.87)
  Bottom Layer w0.254: v1(64.41,24.87) 57.71,24.87 13.15,69.43 v1(13.15,70.38)
LCDG1: length 89.6
  Top Layer w0.254: 14.33,87.81 14.41,87.74 14.41,82.87 13.77,82.23 13.77,70.62 v1(14.06,70.33) ; RN3.2 v1(64.41,25.66)
  Bottom Layer w0.254: v1(14.06,70.33) 14.06,69.38 57.77,25.66 v1(64.41,25.66)
LCDG2: length 88.3
  Top Layer w0.254: RN3.3 v1(64.41,26.47) ; v1(15.06,70.33) 14.48,70.92 14.48,81.81 14.91,82.24 14.91,87.74 FPC2.14
  Bottom Layer w0.254: v1(64.41,26.47) 57.99,26.47 15.06,69.39 v1(15.06,70.33)
LCDG3: length 86.9
  Top Layer w0.254: v1(16.01,70.33) 15.33,71.01 15.33,87.81 ; RN3.4 v1(64.41,27.26)
  Bottom Layer w0.254: v1(16.01,70.33) 16.01,69.31 58.06,27.26 v1(64.41,27.26)
LCDG4: length 84.6
  Top Layer w0.254: RN4.1 v1(64.41,29.86) ; FPC2.16 15.85,87.79 15.85,71.55 v1(17.02,70.38)
  Bottom Layer w0.254: v1(17.02,70.38) 17.02,70.02 57.17,29.86 v1(64.41,29.86)
LCDG5: length 83.4
  Top Layer w0.254: 16.33,87.81 16.33,72.12 v1(17.97,70.48) ; RN4.2 v1(64.41,30.66)
  Bottom Layer w0.254: v1(64.41,30.66) 57.5,30.66 17.97,70.2 v1(17.97,70.48)
LCDG6: length 82.2
  Top Layer w0.254: RN4.3 v1(64.41,31.46) ; FPC2.18 16.83,72.62 v1(18.97,70.48)
  Bottom Layer w0.254: v1(18.97,70.48) 18.97,70.33 57.83,31.46 v1(64.41,31.46)
LCDG7: length 127.7
  Top Layer w0.254: 30.02,45.8 31.15,45.8 R12.1 ; 30.02,45.8 R11.1 ; 30.02,45.8 30.02,45.95 29.18,46.79 v1(28.64,46.79) ; RN4.4 v1(64.41,32.26) ; v1(11.75,70.94) 9.51,68.71 v1(8.29,68.71) ; 17.33,87.81 17.33,73.18 v1(18.46,72.05) v1(19.93,70.59)
  Bottom Layer w0.254: v1(19.93,70.59) 19.93,70.5 58.17,32.26 v1(64.41,32.26) ; 18.44,72.11 12.92,72.11 v1(11.75,70.94) ; v1(8.29,68.71) 8.29,66.05 27.56,46.79 v1(28.64,46.79)
LCDHSYNC: length 65.3
  Top Layer w0.254: 23.33,87.81 23.33,80.16 v1(28.44,75.06) ; RN7.2 v1(64.41,45.66)
  Bottom Layer w0.254: v1(64.41,45.66) 57.96,45.66 28.57,75.06 v1(28.44,75.06)
LCDR0: length 107.9
  Top Layer w0.254: RN1.1 v1(64.41,14.87) ; v1(3.96,70.54) 3.96,81.58 9.33,86.95 FPC2.3
  Bottom Layer w0.254: v1(64.41,14.87) 55.22,14.87 3.96,66.13 v1(3.96,70.54)
LCDR1: length 106
  Top Layer w0.254: v1(5.32,70.48) 5.32,82.26 9.83,86.77 9.83,87.81 ; RN1.2 v1(64.41,15.66)
  Bottom Layer w0.254: v1(5.32,70.48) 5.32,65.82 55.48,15.66 v1(64.41,15.66)
LCDR2: length 104.4
  Top Layer w0.254: v1(6.38,70.54) 6.38,82.66 10.33,86.62 FPC2.5 ; RN1.3 v1(64.41,16.47)
  Bottom Layer w0.254: v1(64.41,16.47) 55.7,16.47 6.38,65.79 v1(6.38,70.54)
LCDR3: length 102.9
  Top Layer w0.254: RN1.4 v1(64.41,17.26) ; 10.83,87.81 10.83,86.25 7.38,82.79 v1(7.38,70.48)
  Bottom Layer w0.254: v1(7.38,70.48) 7.38,65.8 55.91,17.26 v1(64.41,17.26)
LCDR4: length 98.1
  Top Layer w0.254: FPC2.7 11.33,85.43 9.42,83.52 v1(9.42,72.47) ; RN2.1 v1(64.41,19.87)
  Bottom Layer w0.254: v1(64.41,19.87) 57.12,19.87 9.42,67.56 v1(9.42,72.47)
LCDR5: length 96.7
  Top Layer w0.254: 11.83,87.81 11.83,84.71 10.29,83.16 v1(10.29,71) ; RN2.2 v1(64.41,20.66)
  Bottom Layer w0.254: v1(10.29,71) 10.29,67.58 57.2,20.66 v1(64.41,20.66)
LCDR6: length 95.3
  Top Layer w0.254: RN2.3 v1(64.41,21.47) ; 12.33,87.81 12.33,84.29 11.12,83.08 v1(11.12,73.09)
  Bottom Layer w0.254: v1(64.41,21.47) 57.53,21.47 11.1,67.89 11.1,68.69 11.09,68.7 11.09,73.06 v1(11.12,73.09)
LCDR7: length 96.6
  Top Layer w0.254: RN2.4 v1(64.41,22.26) ; 12.83,87.81 12.83,83.93 12.49,83.58 v1(12.49,68.93) ; R9.1 31.15,48.08 R10.1 31.75,48.68 v1(31.75,49.66)
  Bottom Layer w0.254: v1(12.49,68.93) 12.49,68.92 v1(31.75,49.66) 59.14,22.26 v1(64.41,22.26)
LCDVSYNC: length 64
  Top Layer w0.254: RN7.3 v1(64.41,46.46) ; FPC2.32 23.84,80.97 v1(29.69,75.11)
  Bottom Layer w0.254: v1(29.69,75.11) 29.69,75.06 58.29,46.46 v1(64.41,46.46)
LED+: length 37.6
  Top Layer w0.254: U2.5 59.33,4.09 59.69,3.73 59.69,3.28 59.28,2.87 v1(59.23,2.87) ; FPC1.2 42.67,14.15 41.71,13.18 41.71,8.25 42.62,7.34
  Top Layer w0.381: v1(46.79,4.34) 46.37,4.77 D1.1
  Top Layer w0.508: D1.1 46.07,7.13 C2.1 C1.1
  Bottom Layer w0.254: v1(46.79,4.34) 48.26,2.87 v1(59.23,2.87)
LED-: length 16.6
  Top Layer w0.254: R2.1 49.68,13.65 FPC1.1
  Top Layer w0.305: v1(52.75,6.32) 52.74,6.33 52.74,7.76 52.4,8.1 R6.1 52.43,9.3 R2.1 ; U2.3 55,3.43 52.93,3.43 52.75,3.61 v1(52.75,4.04)
  Bottom Layer w0.305: v1(52.75,4.04) v1(52.75,6.32)
TFTB0: length 20.2
  Top Layer w0.254: FPC1.21 50.55,23.65 56.97,30.08 56.97,34.04 57.8,34.86 RN5.8
TFTB1: length 20.5
  Top Layer w0.254: RN5.7 57.58,35.66 56.47,34.55 56.47,30.29 50.34,24.15 FPC1.22
TFTB2: length 20.5
  Top Layer w0.254: RN5.6 57.72,36.46 55.97,34.71 55.97,30.55 50.07,24.65 FPC1.23
TFTB3: length 20.6
  Top Layer w0.254: RN5.5 57.81,37.26 55.47,34.92 55.47,30.81 49.81,25.15 FPC1.24
TFTB4: length 22.3
  Top Layer w0.254: RN6.8 58.13,39.86 54.91,36.65 54.91,31.12 49.45,25.65 FPC1.25
TFTB5: length 22.7
  Top Layer w0.254: FPC1.26 49.19,26.15 54.31,31.27 54.31,37.26 57.71,40.66 RN6.7
TFTB6: length 23.2
  Top Layer w0.254: RN6.6 57.23,41.46 53.75,37.98 53.75,31.42 48.98,26.65 FPC1.27
TFTB7: length 23.3
  Top Layer w0.254: FPC1.28 48.61,27.15 53.19,31.72 53.19,38.33 57.12,42.26 RN6.5
TFTCLK: length 24
  Top Layer w0.254: RN7.8 58.76,44.86 52.63,38.73 52.63,32.08 48.7,28.15 FPC1.30
TFTDE: length 24.1
  Top Layer w0.254: FPC1.34 47.9,30.15 50.95,33.2 50.95,39.7 57.25,46 58,46 59.27,47.26 RN7.5
TFTG0: length 15.4
  Top Layer w0.254: FPC1.13 54.47,19.65 59.68,24.87 RN3.8
TFTG1: length 15.5
  Top Layer w0.254: RN3.7 59.47,25.66 53.96,20.15 FPC1.14
TFTG2: length 15.6
  Top Layer w0.254: RN3.6 59.27,26.47 53.45,20.65 FPC1.15
TFTG3: length 15.7
  Top Layer w0.254: RN3.5 59.06,27.26 52.94,21.15 FPC1.16
TFTG4: length 16.6
  Top Layer w0.254: RN4.8 52.12,21.65 FPC1.17
TFTG5: length 16.7
  Top Layer w0.254: FPC1.18 51.5,22.15 60.01,30.66 RN4.7
TFTG6: length 16.9
  Top Layer w0.254: FPC1.19 51.12,22.65 59.94,31.46 RN4.6
TFTG7: length 17
  Top Layer w0.254: FPC1.20 50.91,23.15 60.03,32.26 RN4.5
TFTHSYNC: length 23.7
  Top Layer w0.254: RN7.7 59.68,45.66 59.24,45.22 58.35,45.22 52.17,39.04 52.17,32.84 48.48,29.15 FPC1.32
TFTR0: length 13.5
  Top Layer w0.254: FPC1.5 47.2,15.58 58.34,15.58 59.06,14.87 RN1.8
TFTR1: length 13.4
  Top Layer w0.254: FPC1.6 47.2,16.08 58.85,16.08 59.27,15.66 RN1.7
TFTR2: length 13.3
  Top Layer w0.254: FPC1.7 58.91,16.65 59.1,16.47 RN1.6
TFTR3: length 13.3
  Top Layer w0.254: FPC1.8 60.22,17.15 RN1.5
TFTR4: length 14.1
  Top Layer w0.254: FPC1.9 57.47,17.65 59.68,19.87 RN2.8
TFTR5: length 14.3
  Top Layer w0.254: RN2.7 59.4,20.66 56.88,18.15 FPC1.10
TFTR6: length 14.4
  Top Layer w0.254: RN2.6 58.98,21.47 56.17,18.65 FPC1.11
TFTR7: length 14.5
  Top Layer w0.254: FPC1.12 55.4,19.15 58.51,22.26 RN2.5
TFTVSYNC: length 23.8
  Top Layer w0.254: FPC1.33 48.12,29.65 51.61,33.15 51.61,39.28 57.9,45.58 58.58,45.58 59.47,46.46 RN7.6
TPCS: length 32.1
  Top Layer w0.254: 25.33,87.81 25.33,88.66 26.26,89.59 39.88,89.59 44.81,94.51 49.17,94.51 50.68,93.01 50.68,90.18
TPMOSI: length 30.3
  Top Layer w0.254: 49.08,90.18 49.08,92.02 48.16,92.94 45.67,92.94 37.9,85.17 27.58,85.17 25.84,86.92 FPC2.36
TPPEN: length 28.3
  Top Layer w0.254: 49.88,90.18 49.88,92.74 48.97,93.65 45.11,93.65 40.46,89 27.76,89 27.33,88.57 27.33,87.81
TPSCK: length 27.4
  Top Layer w0.254: 48.28,90.18 48.28,91.42 47.58,92.13 46.23,92.13 43.38,89.28 43.38,87.61 v1(42.42,86.64) ; 26.82,87.8 26.82,87.1 27.53,86.39 37.69,86.39 v1(38,86.69)
  Bottom Layer w0.254: v1(42.42,86.64) 42.37,86.69 v1(38,86.69)
$1N628: length 11.7
  Top Layer w0.508: U1.2 59.46,9.21 U2.1 52.56,5.04 D1.2
$1N696: length 5.9
  Top Layer w0.254: R15.2 61.02,1.87 60.4,1.25 58.37,1.25 57.59,2.03 U2.4
$1N3439: length 3.5
  Top Layer w0.254: C11.2 13,16.94 11.47,18.48
$1N4082: length 14
  Top Layer w0.254: R5.1 59.66,77.11 R1.1 56.73,77.08 C7.2 53.78,77.06 C6.2 48.94,79.73 FPC3.5

## Copper pours and planes (outline as drawn; the poured copper is in the pictures)
GND on Top Layer: 0,100 67.2,100 67.2,0 0,0
GND on Bottom Layer: 0,100 67.2,100 67.2,0 0,0

Small or netless copper shapes (teardrops, artwork), in the pictures only: 241 on Top Layer, 78 on Bottom Layer

## Text on the board
Top Silkscreen Layer: LCD PARAMETER | 4.3' 800X480 | 4.3' 480X272 | 7' 1024X600 | 7' 800X480 | 7' 1280X800 | NC | M2 | 0 | 1 | M1 | X | M0 | 6 | 40 | JLCJLCJLCJLC
